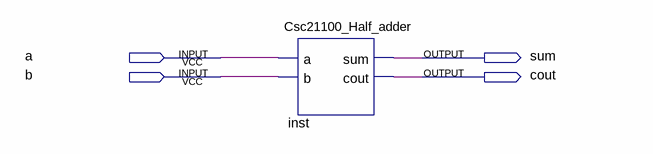
[diagram p0: schematic sheet]
// Quartus schematic Block.bdf as structural Verilog: 1 symbols, 4 pins
module Block (
  input  a,
  input  b,
  output sum,
  output cout
);

  Csc21100_Half_adder inst (.a(a), .b(b), .sum(sum), .cout(cout));
endmodule
